# EAGLE design kegmon_hx711 (EAGLE 6.3)
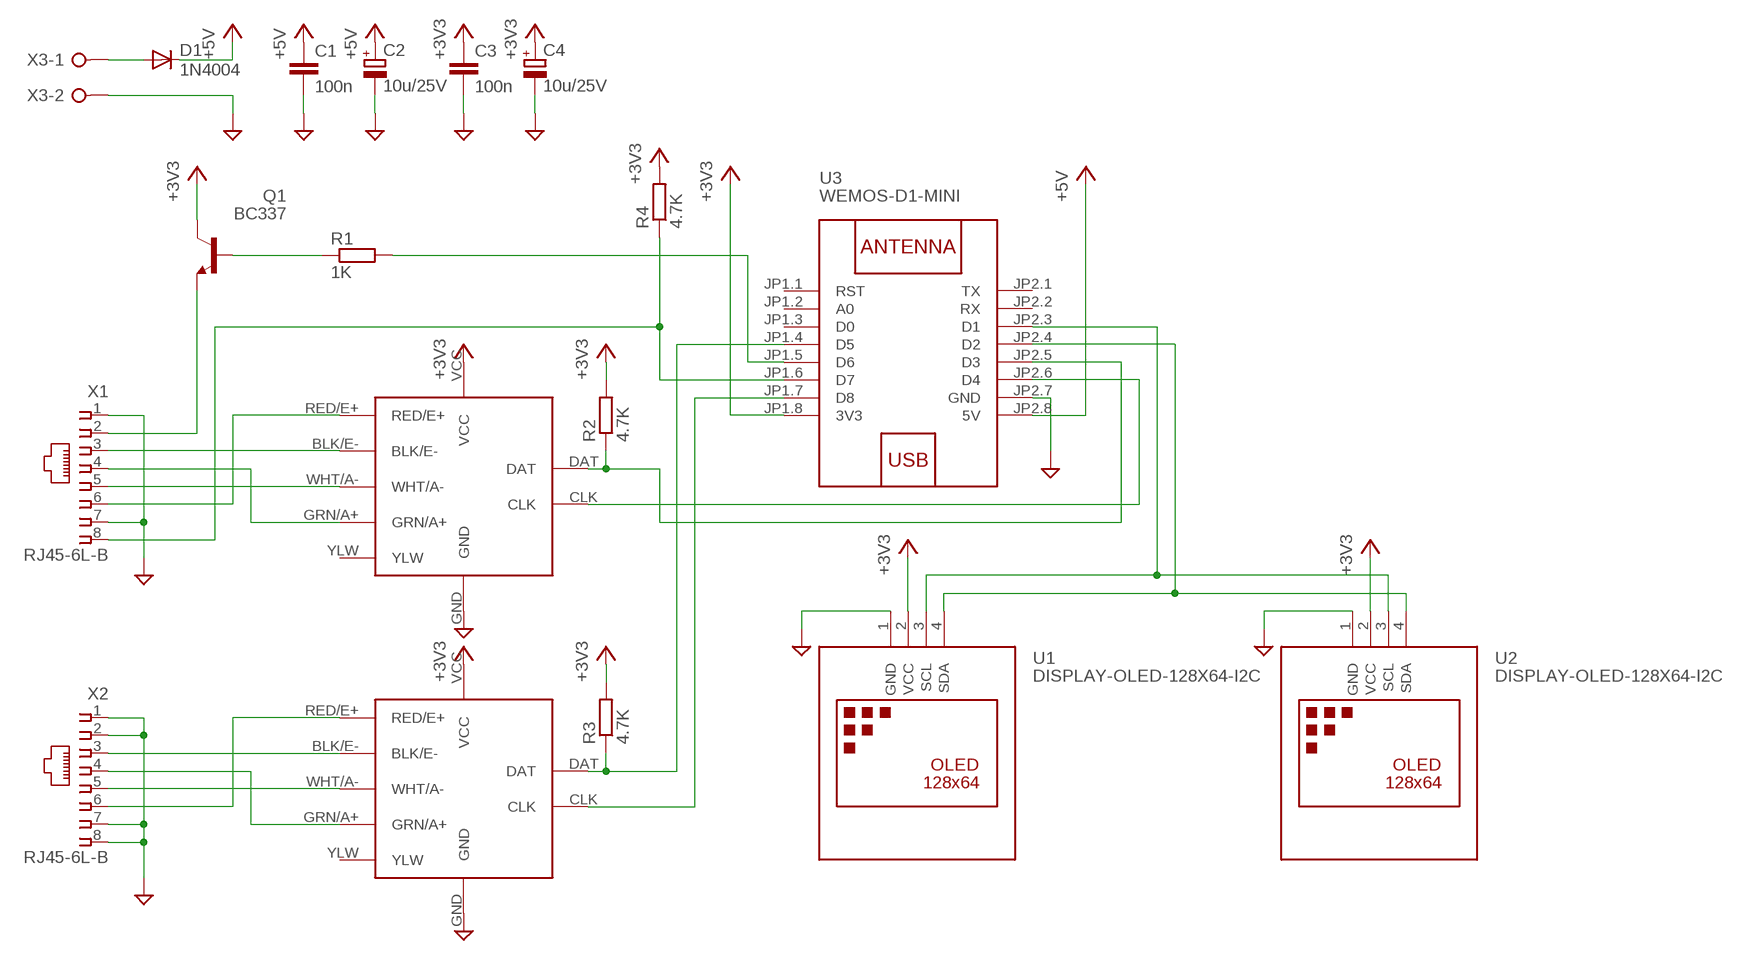
[diagram p0: schematic, sheet 1]

## Parts
C1  100n  C-EU050-025X075  [C050-025X075]
C2  10u/25V  CPOL-EUE2.5-5  [E2,5-5]
C3  100n  C-EU050-025X075  [C050-025X075]
C4  10u/25V  CPOL-EUE2.5-5  [E2,5-5]
D1  1N4004  [DO41-10]
IC1  SPARKFUN-HX711  [SPARKFUN-HX711]
IC2  SPARKFUN-HX711  [SPARKFUN-HX711]
Q1  BC337  [TO92]
R1  1K  R-EU_0207/10  [0207/10]
R2  4.7K  R-EU_0207/10  [0207/10]
R3  4.7K  R-EU_0207/10  [0207/10]
R4  4.7K  R-EU_0207/10  [0207/10]
U1  DISPLAY-OLED-128X64-I2C  DISPLAY-OLED-128X64-I2CDISPLAY-OLED-128X64-I2C-NOHOLES  [DISPLAY-OLED-128X64-I2C-NOHOLES]
U2  DISPLAY-OLED-128X64-I2C  DISPLAY-OLED-128X64-I2CDISPLAY-OLED-128X64-I2C-NOHOLES  [DISPLAY-OLED-128X64-I2C-NOHOLES]
U3  WEMOS-D1-MINI  [WEMOS-D1-MINI]
X1  RJ45-6L-B  [RJ45-NO-SHIELD]
X2  RJ45-6L-B  [RJ45-NO-SHIELD]
X3  W237-02P  [W237-132]

## Nets
+3V3: C3.1 C4.+ IC1.VCC IC2.VCC Q1.3(C) R2.2 R3.2 R4.2 U1.2(VCC) U2.2(VCC) U3.JP1.8(3V3)
+5V: C1.1 C2.+ D1.C U3.JP2.8(5V)
GND: C1.2 C2.- C3.2 C4.- IC1.GND IC2.GND U1.1(GND) U2.1(GND) U3.JP2.7(GND) X1.1 X1.7 X2.1 X2.2 X2.7 X2.8 X3.2
N$1: Q1.2(B) R1.1
N$2: U1.3(SCL) U2.3(SCL) U3.JP2.3(D1)
N$3: D1.A X3.1
N$4: IC1.RED/E+ X1.6
N$5: IC1.BLK/E- X1.3
N$6: R4.1 U3.JP1.6(D7) X1.8
N$8: IC1.WHT/A- X1.5
N$9: IC1.GRN/A+ X1.4
N$10: IC2.BLK/E- X2.3
N$11: IC2.RED/E+ X2.6
N$12: IC2.GRN/A+ X2.4
N$13: IC2.WHT/A- X2.5
N$14: IC1.DAT R2.1 U3.JP2.5(D3)
N$15: IC1.CLK U3.JP2.6(D4)
N$16: IC2.DAT R3.1 U3.JP1.4(D5)
N$17: IC2.CLK U3.JP1.7(D8)
N$18: U1.4(SDA) U2.4(SDA) U3.JP2.4(D2)
N$20: Q1.1(E) X1.2
N$22: R1.2 U3.JP1.5(D6)
Unconnected: IC1.YLW IC2.YLW U3.JP1.1(RST) U3.JP1.2(A0) U3.JP1.3(D0) U3.JP2.1(TX) U3.JP2.2(RX)

## Library data of the parts
C1 C3 = rcl:C-EU: CAPACITOR, European symbol
C2 C4 = rcl:CPOL-EU: POLARIZED CAPACITOR, European symbol
D1 = diode:1N4004: DIODE general purpose rectifier, 1 A
IC1 IC2 = diy-modules:SPARKFUN-HX711
Q1 = transistor-npn:BC337*: NPN Transistor
R1-R4 = rcl:R-EU_: RESISTOR, European symbol
U1 U2 = diy-modules:DISPLAY-OLED-128X64-I2C: 128x64 Dot Matrix OLED Module based on SSD1306 chip Variant with I2C interface More details available here: http://www.instructables.com/id/Monochrome-096-i2c-OLED-display-with-arduino-SSD13/ SSD1306 datasheet: https://cdn-shop.adafruit.com/datasheets/SSD1306.pdf Click here to find device on ebay.com <http://www.ebay.com/sch/oled+display+128x64+iic> Note: There are two variants: I2C and SPI. Search for the proper version.
U3 = diy-modules:WEMOS-D1-MINI: WEMOS D1 mini: Mini Wi-Fi Board based on ESP-8266 device More details can be found here: https://www.wemos.cc/product/d1-mini.html Click here to find device on ebay.com <http://www.ebay.com/sch/wemos+d1+mini+nodemcu>
X1 X2 = con-tycoelectronics:RJ45: CORCOM Modular RJ Jacks No Shield Source: www.tycoelectronics.com .. ENG_DS_1654001_1099_RJ_L_0507.pdf; MPN: RJ45-6L-B; OC_FARNELL: unknown; OC_NEWARK: 16R6090
X3 = con-wago-508:W237-02P: WAGO SREW CLAMP; OC_FARNELL: unknown; OC_NEWARK: unknown

## Board
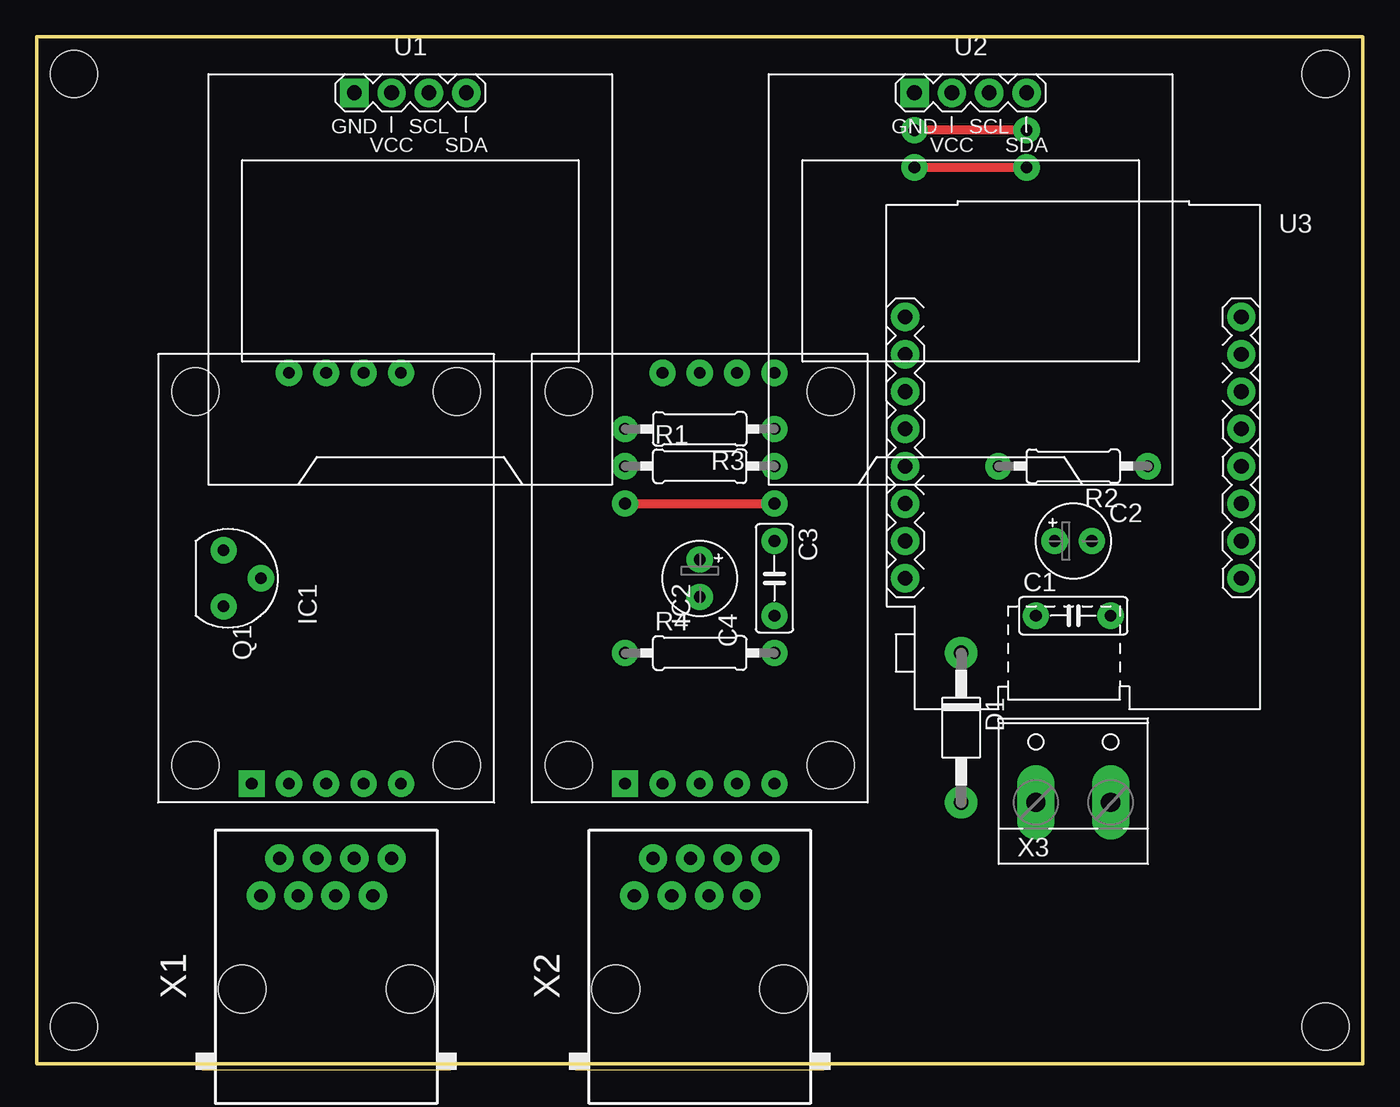
[diagram p1: board, top side]
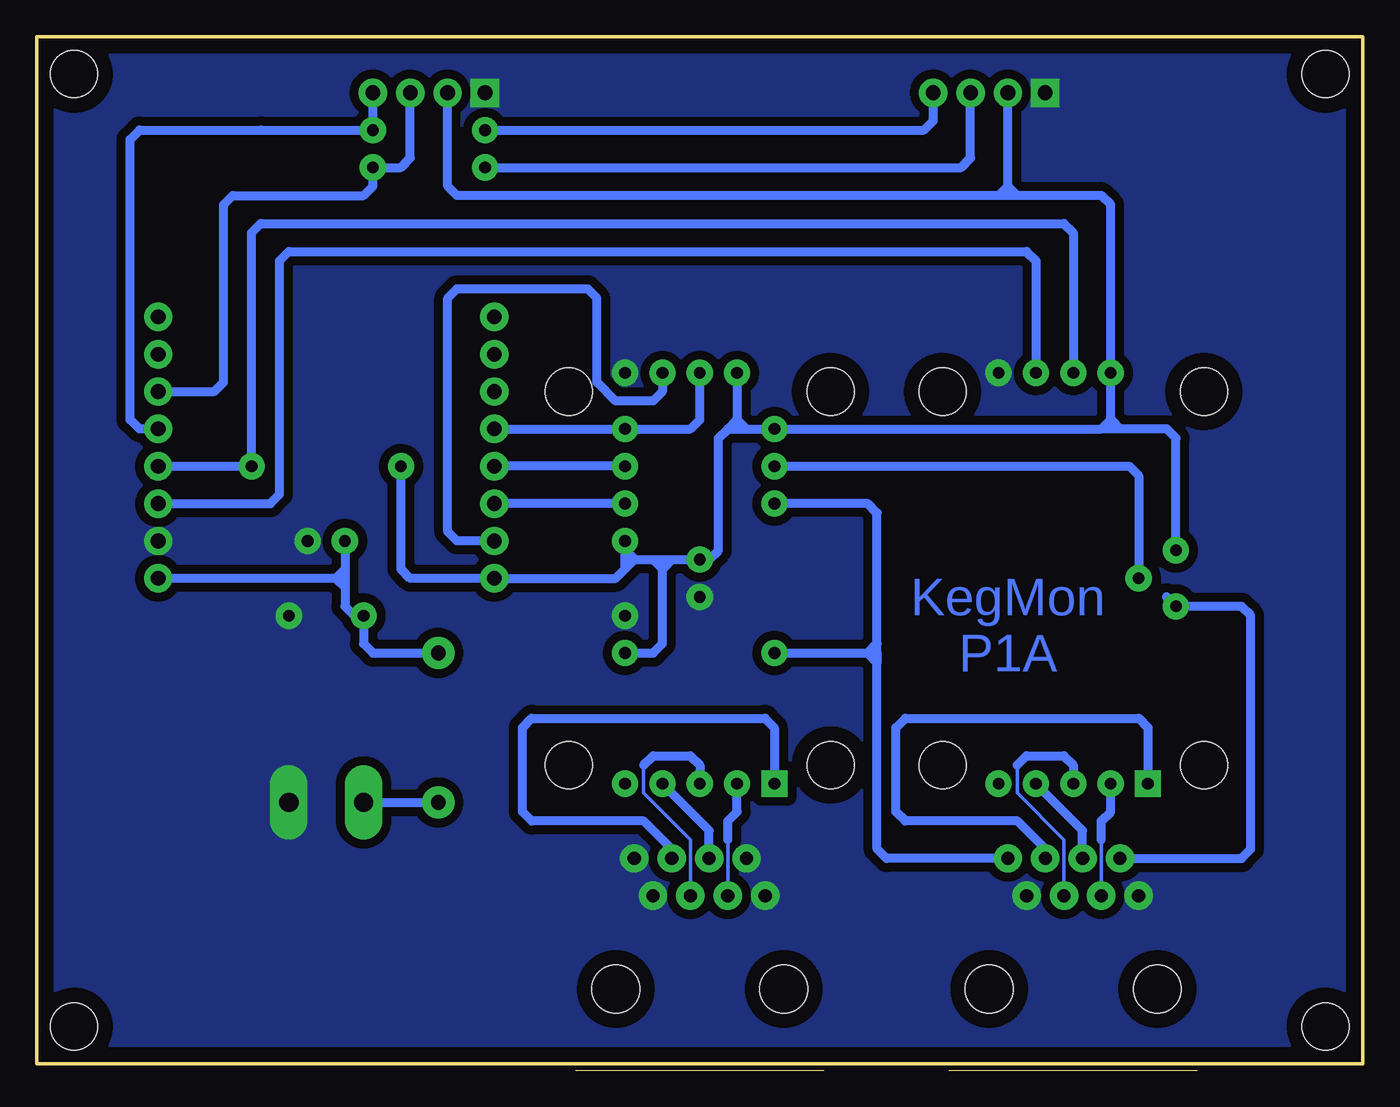
[diagram p2: board, bottom side, seen from below]

Size 90.17 x 69.85 mm. Coordinates in mm from the lower left corner, seen from the top.
Outline: 0,0 90.17,0 90.17,69.85 0,69.85 0,0
Copper layers (1*16): Top 0.035mm / dielectric 1.5mm / Bottom 0.035mm
Design rules "default": minimum track width 10mil, minimum drill 24mil, track to track 8mil, track to pad 8mil, pad to pad 8mil, via to via 8mil, smd to smd 8mil, copper to edge 40mil, drill to drill 8mil, minimum pad ring 10mil, minimum via ring 8mil, stop-mask expansion 4mil, vias tented up to drill 0mil, thermal gap 10mil
Holes 3.2 mm at 2.54,2.54 2.54,67.31 87.63,67.31 87.63,2.54

### Footprints (pad centres in the part's own frame; a part is rotated, then mirrored left to right if it is on the bottom)
C050-025X075 = drill 0.8 pad 1.778: 1 -2.54,0; 2 2.54,0
E2,5-5 = drill 0.8 pad 1.778: + -1.27,0; - 1.27,0
DO41-10 = drill 1 pad 2.184: A 5.08,0; C -5.08,0
SPARKFUN-HX711 = drill 0.8 pad 1.778: BLK/E- -13.97,2.54; CLK 13.97,-2.54; DAT 13.97,0; GND 13.97,-5.08; GRN/A+ -13.97,-2.54; VCC 13.97,2.54; WHT/A- -13.97,0; YLW -13.97,-5.08 | drill 0.8 pad 1.778 square: RED/E+ -13.97,5.08 | hole 3.2: -12.7,8.89; 12.7,8.89; -12.7,-8.89; 12.7,-8.89
TO92 = drill 0.8 pad 1.778: 1 1.905,0; 2 0,2.54; 3 -1.905,0
0207/10 = drill 0.8 pad 1.778: 1 -5.08,0; 2 5.08,0
DISPLAY-OLED-128X64-I2C-NOHOLES = drill 1 pad 1.93 square: 1 -3.81,12.7 | drill 1 pad 1.93: 2 -1.27,12.7; 3 1.27,12.7; 4 3.81,12.7
WEMOS-D1-MINI = drill 1 pad 1.93: JP1.1 -11.43,9.525; JP1.2 -11.43,6.985; JP1.3 -11.43,4.445; JP1.4 -11.43,1.905; JP1.5 -11.43,-0.635; JP1.6 -11.43,-3.175; JP1.7 -11.43,-5.715; JP1.8 -11.43,-8.255; JP2.1 11.43,9.525; JP2.2 11.43,6.985; JP2.3 11.43,4.445; JP2.4 11.43,1.905; JP2.5 11.43,-0.635; JP2.6 11.43,-3.175; JP2.7 11.43,-5.715; JP2.8 11.43,-8.255
RJ45-NO-SHIELD = drill 0.9 pad 1.93: 1 -4.445,6.35; 2 -3.175,8.89; 3 -1.905,6.35; 4 -0.635,8.89; 5 0.635,6.35; 6 1.905,8.89; 7 3.175,6.35; 8 4.445,8.89 | hole 3.251: -5.715,0; 5.715,0
W237-132 = drill 1.3 pad 2.54 long: 1 -2.54,0; 2 2.54,0

### Placement (x,y rotation side)
C1  70.48,30.48 0 top
C2  70.48,35.56 0 top
C3  50.16,33.02 270 top
C4  45.09,33.02 270 top
D1  62.87,22.86 270 top
IC1  19.68,33.02 90 top
IC2  45.09,33.02 90 top
Q1  12.7,33.02 270 top
R1  45.09,40.64 0 top
R2  70.48,40.64 180 top
R3  45.09,43.18 180 top
R4  45.09,27.94 0 top
U1  25.4,53.34 0 top
U2  63.5,53.34 0 top
U3  70.48,41.27 0 top
X1  19.68,5.08 0 top
X2  45.09,5.08 0 top
X3  70.48,17.78 0 top

### Tracks (layer width: path | path; a pad name or v marks a point on that pad's centre or on a via)
+3V3
  Bottom 0.61: 50.16,34.29 49.53,34.29 | 49.53,34.29 48.26,34.29 | 48.26,34.29 47.62,34.29 | 46.99,34.29 C4.+ 44.45,34.29 43.81,34.92 43.81,42.55 43.18,43.18 | R2.2 65.41,33.66 64.77,33.02 U3.JP1.8 50.8,33.02 50.16,33.66 | 50.16,33.66 50.16,34.29 | 50.16,34.29 50.16,34.92 | 50.16,34.92 C3.1 | IC2.VCC 42.55,43.81 | 42.55,43.81 42.55,43.18 | 42.55,43.18 41.91,43.18 | 41.91,43.18 R3.2 17.78,43.18 | 17.78,43.18 17.14,43.81 | 17.14,43.81 IC1.VCC 17.14,58.42 17.78,59.05 23.5,59.05 | 23.5,59.05 24.13,59.05 | 24.13,59.05 24.13,59.69 | 24.13,59.69 U1.2 | 43.18,43.18 42.55,43.18 | 24.13,59.05 24.77,59.05 | 24.77,59.05 61.59,59.05 62.23,59.69 U2.2 | 41.91,43.18 42.55,43.81 | 42.55,43.81 43.18,43.18 | 50.16,33.66 49.53,34.29 | 49.53,34.29 50.16,34.92 | 23.5,59.05 24.13,59.69 | 24.13,59.69 24.77,59.05 | Q1.3 12.7,42.55 13.34,43.18 16.51,43.18 | 16.51,43.18 17.14,43.18 | 17.14,43.18 17.78,43.18 | 17.14,43.18 17.14,43.81 | 17.14,43.81 16.51,43.18 | R4.2 48.26,27.94 47.62,28.57 47.62,33.66 | 47.62,33.66 47.62,34.29 | 47.62,34.29 46.99,34.29 | 46.99,34.29 47.62,33.66 | 47.62,33.66 48.26,34.29
+5V
  Bottom 0.61: C2.+ 69.22,33.66 | 69.22,33.66 69.22,33.02 | 69.22,33.02 69.22,32.38 | 69.22,32.38 69.22,31.11 68.58,30.48 C1.1 67.94,28.57 67.31,27.94 D1.C | 69.22,33.02 69.85,33.02 | 69.85,33.02 U3.JP2.8 | 69.22,32.38 69.85,33.02 | 69.85,33.02 69.22,33.66
GND
  pour Bottom (isolate 0.61, no thermals): 0,0 90.17,0 90.17,69.85 0,69.85
N$1
  Bottom 0.61: R1.1 15.88,40.64 15.24,40.01 Q1.2
N$2  (via drill 0.8 pad 1.78)
  Top 0.61: v67.31,60.96 v59.69,60.96
  Bottom 0.61: U3.JP2.3 78.11,45.72 77.47,46.35 77.47,58.42 76.83,59.05 67.94,59.05 67.31,59.69 v67.31,60.96 65.41,60.96 64.77,61.59 U2.3 | v59.69,60.96 27.3,60.96 26.67,61.59 U1.3
N$3
  Bottom 0.61: X3.1 D1.A
N$4
  Bottom 0.61: IC1.RED/E+ 14.61,22.86 15.24,23.5 31.11,23.5 31.75,22.86 31.75,17.14 31.11,16.51 23.5,16.51 21.59,14.61 X1.6
N$5
  Bottom 0.254: X1.3 17.78,15.24
  Bottom 0.61: IC1.BLK/E- 17.14,17.14 17.78,16.51 17.78,15.24
N$6  (via drill 0.8 pad 1.78)
  Top 0.61: v40.01,38.1 v50.16,38.1
  Bottom 0.61: 33.02,27.3 33.02,14.61 32.38,13.97 X1.8 | 33.02,27.94 33.02,28.57 | 33.02,28.57 33.02,37.47 33.66,38.1 v40.01,38.1 | v50.16,38.1 U3.JP1.6 | R4.1 33.66,27.94 | 33.66,27.94 33.02,27.94 | 33.02,27.94 33.02,27.3 | 33.02,27.3 33.66,27.94 | 33.66,27.94 33.02,28.57
N$8
  Bottom 0.254: X1.5 20.32,15.24 23.5,18.41 23.5,20.32
  Bottom 0.61: 23.5,20.32 22.86,20.95 20.32,20.95 19.68,20.32 IC1.WHT/A-
N$9
  Bottom 0.61: IC1.GRN/A+ 19.05,15.88 X1.4
N$10
  Bottom 0.254: X2.3 43.18,15.24
  Bottom 0.61: IC2.BLK/E- 42.55,17.14 43.18,16.51 43.18,15.24
N$11
  Bottom 0.61: X2.6 46.99,14.61 48.9,16.51 56.52,16.51 57.15,17.14 57.15,22.86 56.52,23.5 40.64,23.5 40.01,22.86 IC2.RED/E+
N$12
  Bottom 0.61: IC2.GRN/A+ 44.45,15.88 X2.4
N$13
  Bottom 0.254: X2.5 45.72,15.24 48.9,18.41 48.9,20.32
  Bottom 0.61: 48.9,20.32 48.26,20.95 45.72,20.95 45.09,20.32 IC2.WHT/A-
N$14
  Bottom 0.61: U3.JP2.5 R2.1 75.56,56.52 74.93,57.15 20.32,57.15 19.68,56.52 IC1.DAT
N$15
  Bottom 0.61: U3.JP2.6 74.3,38.1 73.66,38.73 73.66,54.61 73.03,55.24 22.86,55.24 22.23,54.61 IC1.CLK
N$16
  Bottom 0.61: IC2.DAT 45.09,43.81 45.72,43.18 R3.1 U3.JP1.4
N$17
  Bottom 0.61: U3.JP1.7 61.59,35.56 62.23,36.2 62.23,52.07 61.59,52.7 52.7,52.7 52.07,52.07 52.07,46.35 50.8,45.09 48.26,45.09 47.62,45.72 IC2.CLK
N$18  (via drill 0.8 pad 1.78)
  Top 0.61: v67.31,63.5 v59.69,63.5
  Bottom 0.61: U2.4 v67.31,63.5 74.93,63.5 83.19,63.5 83.82,62.87 83.82,43.81 83.19,43.18 U3.JP2.4 | v59.69,63.5 29.84,63.5 29.21,64.14 U1.4
N$20
  Bottom 0.61: X1.2 8.26,13.97 7.62,14.61 7.62,30.48 8.26,31.11 Q1.1 13.34,31.75
N$22
  Bottom 0.61: R1.2 U3.JP1.5

### Text on the board
Bottom: KegMon | P1A